# EasyEDA Pro project CD Air Detector_V2.0.eprj

# Schematic Schematic1
Create Date: 2024-07-20; Page Name: P1; Project Name: CC Air Detector_V2.0; Schematic Name: Schematic1; Update Date: 2024-07-20
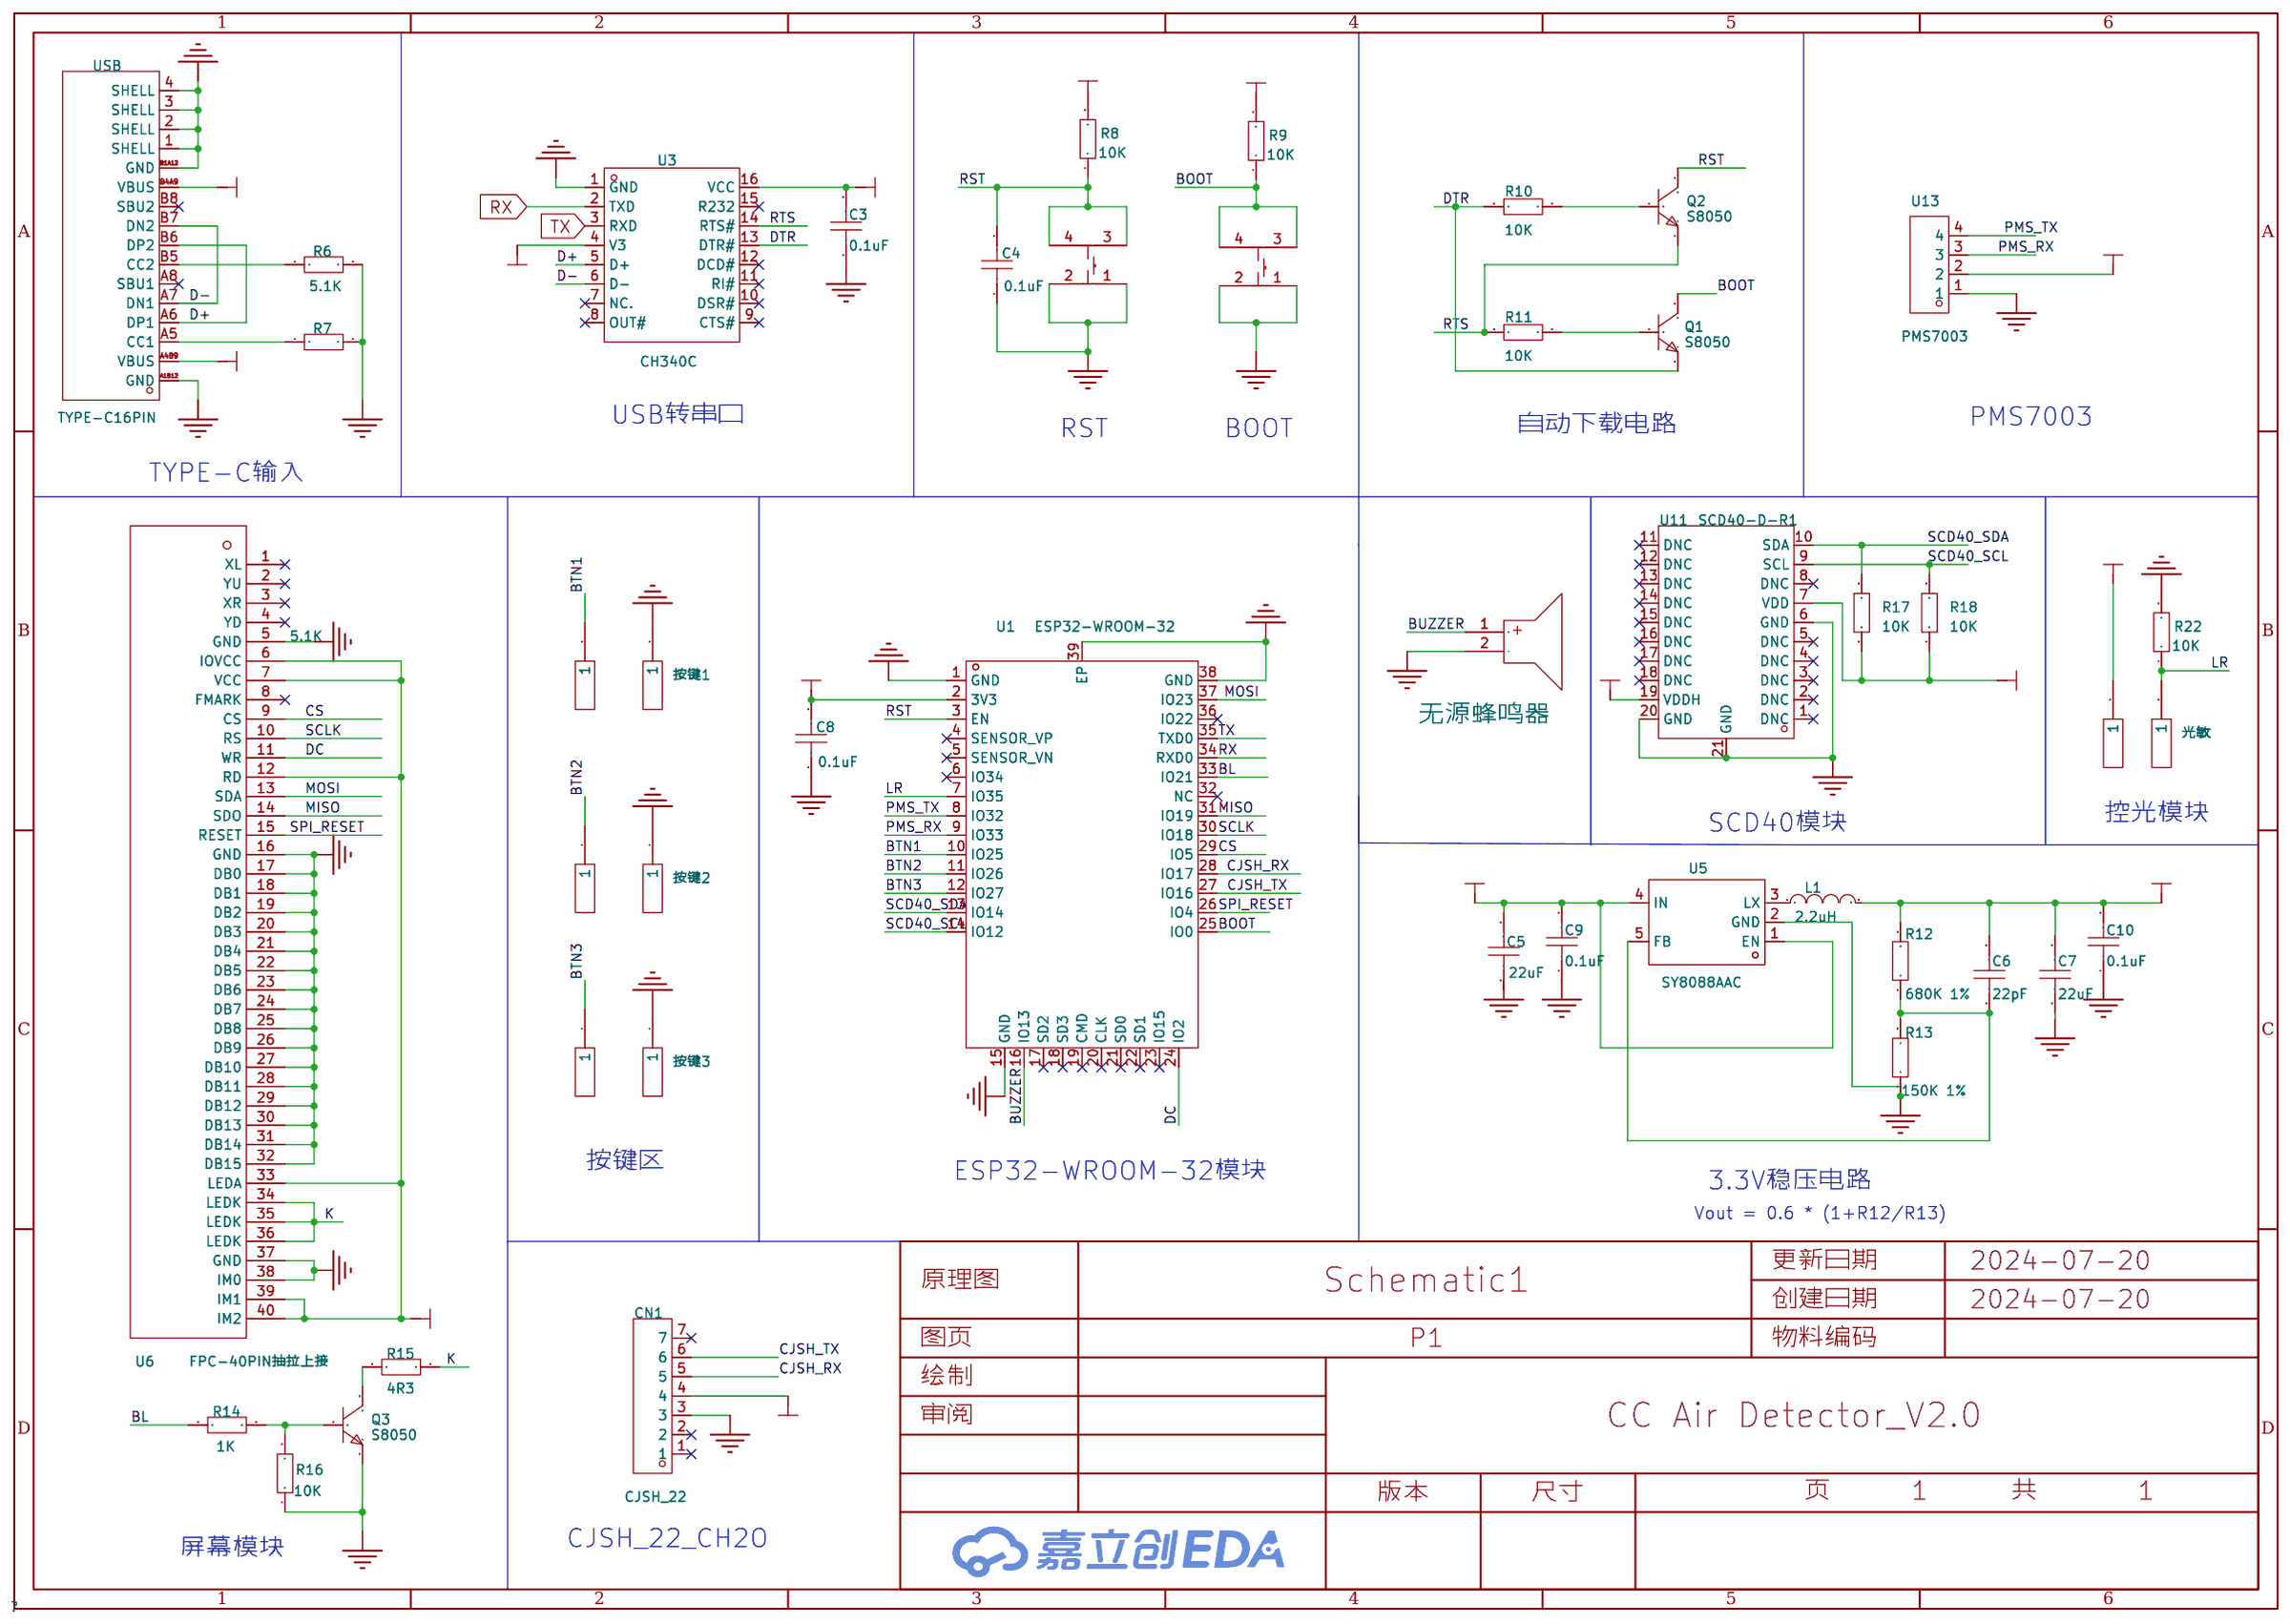
[diagram p0: schematic sheet]

## Parts
C3  0.1uF  [C0805]
C4  0.1uF  [C0805]
C5  22uF  [C0805]
C6  22pF  [C0805]
C7  22uF  [C0805]
C8  0.1uF  [C0805]
C9  0.1uF  [C0805]
C10  0.1uF  [C0805]
CN1  CJSH_22  [CONN-TH_1.25T-7P-DP]
L1  2.2uH  [0630电感]
Q1  S8050  [SOT-23-3_L2.9-W1.3-P1.90-LS2.4-BR]
Q2  S8050  [SOT-23-3_L2.9-W1.3-P1.90-LS2.4-BR]
Q3  S8050  [SOT-23-3_L2.9-W1.3-P1.90-LS2.4-BR]
R6  5.1K  [R0805]
R7  5.1K  [R0805]
R8  10K  [R0805]
R9  10K  [R0805]
R10  10K  [R0805]
R11  10K  [R0805]
R12  680K 1%  [R0805]
R13  150K 1%  [R0805]
R14  1K  [R0805]
R15  4R3  [R0805]
R16  10K  [R0805]
R17  10K  [R0805]
R18  10K  [R0805]
R22  10K  [R0805]
U1  ESP32-WROOM-32  [WIFIM-SMD_ESP-WROOM-32]
U2  贴片按键(轻触开关)  [SW-SMD_4P-L4.2-W3.2-P2.15-LS4.6]
U3  CH340C  [SOP-16_L10.0-W3.9-P1.27-LS6.0-BL]
U4  贴片按键(轻触开关)  [SW-SMD_4P-L4.2-W3.2-P2.15-LS4.6]
U5  SY8088AAC  [SOT-23-5_L3.0-W1.7-P0.95-LS2.8-BR]
U6  FPC-40PIN抽拉上接  [FPC_40PIN]
U8  -  [长圆形单面焊盘]
U9  -  [长圆形单面焊盘]
U10  -  [长圆形单面焊盘]
U11  SCD40-D-R1  [LGA-20_L10.1-W10.1-P1.25-TL]
U12  -  [长圆形单面焊盘]
U13  PMS7003  [CONN-TH_4P-P2.50-XH2.54-4P]
USB  TYPE-C16PIN  [USB-C-SMD_TYPE-C16PIN]
光敏  -  [长圆形单面焊盘]
按键1  -  [长圆形单面焊盘]
按键2  -  [长圆形单面焊盘]
按键3  -  [长圆形单面焊盘]
无源蜂鸣器  无源蜂鸣器  [SMD7525 BEEP]

## Library data of the parts
C3-C5 C8-C10 = CAP_0805: Supplier Footprint: 0805
C6 C7 = CAP_0603: Supplier Footprint: 0603
CN1 = 1.25T-7P-DP: 插针结构:1x7P;间距:1.25mm;安装方式:直插;参考系列:-;总PIN数:7P;排数:1;每排PIN数:7;行距:-;额定电流:1A;工作温度范围:-25℃~+85℃;; LCSC Part Name: 1x7P 间距:1.25mm 直插; Supplier Part: C2689929; Manufacturer: 韩国韩荣; Supplier Footprint: 插件,P=1.25mm; JLCPCB Part Class: 扩展库; Datasheet: https://atta.szlcsc.com/upload/public/pdf/source/20210511/C145936_7E552BBBEA0510A148F12D708BF3BB1D.pdf; Supplier: LCSC; Pins Structure: 1x7P; Pitch: 1.25mm; Mounting Style: 直插; Number of Pins: 7P; Number of Rows: 1; Number of PINs Per Row: 7; Current Rating (Max): 1A; Operating Temperature Range: -25℃~+85℃
L1 = L_0805: Supplier Footprint: L0805
Q1-Q3 = S8050: NPN 25V 500mA 120-400 SOT-23; Supplier Part: C2931719; Manufacturer: Doeshare(德芯); Supplier Footprint: SOT-23; JLCPCB Part Class: 扩展库; Datasheet: https://atta.szlcsc.com/upload/public/pdf/source/20220117/E6D3315E0D6ADDB25840BFFAC039C5C0.pdf; Supplier: LCSC
R6-R11 R15-R18 R22 = Res_0805: Supplier Footprint: 0805
R12-R14 = Res_0603: Supplier Footprint: 0603
U1 = ESP32-WROOM-32: WiFi+双模蓝牙 双核CPU 网口 顶配MCU 低功耗蓝牙 ESP32系列ESP-WROOM-32模组/ESP-32S 4MB; Supplier Part: C95209; Manufacturer: ESPRESSIF(乐鑫); JLCPCB Part Class: 扩展库; Datasheet: https://atta.szlcsc.com/upload/public/pdf/source/20170925/C95209_1506321763821990573.pdf; Supplier: LCSC
U2 U4 = 贴片按键(轻触开关): Supplier Part: C9900009062; Supplier Footprint: PTS810-3mm*4mm*2.5mm(4脚); JLCPCB Part Class: 扩展库; Supplier: LCSC
U3 = CH340C: 应用功能:收发器;接口协议:USB 2.0;数据速率:2Mbps;; LCSC Part Name: CH340C USB转串口芯片 CH340; Supplier Part: C84681; Manufacturer: WCH(南京沁恒); Supplier Footprint: SOP-16; JLCPCB Part Class: 扩展库; Datasheet: https://atta.szlcsc.com/upload/public/pdf/source/20200819/C84681_ADBED554CE321879DBD6B1D06488689C.pdf; Supplier: LCSC; Applications Function: 收发器; Protocol: USB 2.0; Supply Voltage: 3.3V；5V; Data Rate: 2Mbps
U5 = SY8088AAC: 功能类型:降压型;输入电压:-;输出电流(最大值):-;; Supplier Part: C79313; Manufacturer: silergy(矽力杰); Supplier Footprint: SOT-23-5; JLCPCB Part Class: 扩展库; Datasheet: https://atta.szlcsc.com/upload/public/pdf/source/20170329/1490752163260.pdf; Supplier: LCSC; Function: 降压型; Switch tube (built-in/external): 内置
U6 = FPC_连接器_40PIN
U8-U10 U12 光敏 按键1-按键3 = 长圆形单面焊盘
U11 = SCD40-D-R1: 气体类型:空气质量;精度:±5%;; LCSC Part Name: 3.000.496; Supplier Part: C3037696; Manufacturer: Sensirion(瑞士盛思锐); Supplier Footprint: SMD; JLCPCB Part Class: 扩展库; Datasheet: https://atta.szlcsc.com/upload/public/pdf/source/20230320/B8496A095FB9AF4BA49DBD56DDF6C7AD.pdf; Supplier: LCSC; Type: 空气质量; Resolution: ±5%; Operating Temperature: -10℃~+60℃
U13 = xh2.54-4p(直针): Supplier Part: C9900015350; JLCPCB Part Class: 扩展库; Supplier: LCSC
USB = TYPE-C16PIN: 连接器类型:Type-C;标准:-;公母:母;端口数量:1;触点数量:16P;安装方式:卧贴;额定电流 - 电源:3A;工作温度范围:-40℃~+85℃;; LCSC Part Name: Type-C 母 卧贴; Supplier Part: C393939; Manufacturer: SHOU HAN(首韩); Supplier Footprint: SMD; JLCPCB Part Class: 扩展库; Datasheet: https://atta.szlcsc.com/upload/public/pdf/source/20190521/C393939_7B9043D4CF1026AF443AB60D91FBCD5C.pdf; Supplier: LCSC; Connector Type: Type-C; Gender: 母; Number of Ports: 1; Number of Contacts: 16P; Mounting Style: 卧贴; Current Rating - Power (Max): 3A; Operating Temperature Range: -40℃~+85℃
无源蜂鸣器 = YS-MBZ12095C05R42K4000: LCSC Part Name: 蜂鸣器 无源5V42欧4000HZ; Supplier Part: C2891357; Manufacturer: Fengming(锋鸣电子); Supplier Footprint: 插件,P=6.5mm; Datasheet: https://atta.szlcsc.com/upload/public/pdf/source/20210903/1BFBC8824417868F880E44F43CB98B3A.pdf; Supplier: LCSC

## Nets
3V3: C3.2 C6.2 C7.2 C8.2 C10.2 L1.2 R8.2 R9.2 R12.2 R17.1 R18.1 U1.2(3V3) U3.4(V3) U3.16(VCC) U6.6(IOVCC) U6.7(VCC) U6.12(RD) U6.33(LEDA) U6.39(IM1) U6.40(IM2) U11.7(VDD) U11.19(VDDH) U12.1
GND: C3.1 C4.1 C5.1 C7.1 C8.1 C9.1 C10.1 CN1.3 Q3.2(E) R6.2 R7.2 R13.1 R16.1 R22.2 U1.1(GND) U1.15(GND) U1.38(GND) U1.39(EP) U2.1 U2.2 U3.1(GND) U4.1 U4.2 U5.2(GND) U6.5(GND) U6.16(GND) U6.17(DB0) U6.18(DB1) U6.19(DB2) U6.20(DB3) U6.21(DB4) U6.22(DB5) U6.23(DB6) U6.24(DB7) U6.25(DB8) U6.26(DB9) U6.27(DB10) U6.28(DB11) U6.29(DB12) U6.30(DB13) U6.31(DB14) U6.32(DB15) U6.37(GND) U6.38(IM0) U11.6(GND) U11.20(GND) U11.21(GND) U13.1 USB.1(SHELL) USB.2(SHELL) USB.3(SHELL) USB.4(SHELL) USB.A1B12(GND) USB.B1A12(GND) 按键1.1 按键2.1 按键3.1 无源蜂鸣器.2(-)
VBUS: C5.2 C9.2 CN1.4 U5.1(EN) U5.4(IN) U13.2 USB.A4B9(VBUS) USB.B4A9(VBUS)
BL: R14.1 U1.33(IO21)
BOOT: Q1.3(C) R9.1 U1.25(IO0) U4.3 U4.4
BTN1: U1.10(IO25) U8.1
BTN2: U1.11(IO26) U9.1
BTN3: U1.12(IO27) U10.1
BUZZER: U1.16(IO13) 无源蜂鸣器.1(+)
CJSH_RX: CN1.5 U1.28(IO17)
CJSH_TX: CN1.6 U1.27(IO16)
CS: U1.29(IO5) U6.9(CS)
D+: U3.5(D+) USB.A6(DP1) USB.B6(DP2)
D-: U3.6(D-) USB.A7(DN1) USB.B7(DN2)
DC: U1.24(IO2) U6.11(WR)
DTR: Q1.2(E) R10.1 U3.13(DTR#)
K: R15.2 U6.34(LEDK) U6.35(LEDK) U6.36(LEDK)
LR: R22.1 U1.7(IO35) 光敏.1
MISO: U1.31(IO19) U6.14(SDO)
MOSI: U1.37(IO23) U6.13(SDA)
PMS_RX: U1.9(IO33) U13.3
PMS_TX: U1.8(IO32) U13.4
RST: C4.2 Q2.3(C) R8.1 U1.3(EN) U2.3 U2.4
RTS: Q2.2(E) R11.1 U3.14(RTS#)
RX: U1.34(RXD0) U3.2(TXD)
SCD40_SCL: R18.2 U1.14(IO12) U11.9(SCL)
SCD40_SDA: R17.2 U1.13(IO14) U11.10(SDA)
SCLK: U1.30(IO18) U6.10(RS)
SPI_RESET: U1.26(IO4) U6.15(RESET)
TX: U1.35(TXD0) U3.3(RXD)
$1N3236: R6.1 USB.B5(CC2)
$1N3239: R7.1 USB.A5(CC1)
$1N4518: Q2.1(B) R10.2
$1N4546: Q1.1(B) R11.2
$1N5000: L1.1 U5.3(LX)
$1N5124: C6.1 R12.1 R13.2 U5.5(FB)
$1N7211: Q3.1(B) R14.2 R16.2
$1N8578: Q3.3(C) R15.1

Not connected (* = marked no-connect by the designer): CN1 1* 2* 7*; U1 4(SENSOR_VP)* 5(SENSOR_VN)* 6(IO34)* 17(SD2)* 18(SD3)* 19(CMD)* 20(CLK)* 21(SD0)* 22(SD1)* 23(IO15)* 32(NC)* 36(IO22)*; U3 7(NC.)* 8(OUT#)* 9(CTS#)* 10(DSR#)* 11(RI#)* 12(DCD#)* 15(R232)*; U6 1(XL)* 2(YU)* 3(XR)* 4(YD)* 8(FMARK)*; U11 1(DNC)* 2(DNC)* 3(DNC)* 4(DNC)* 5(DNC)* 8(DNC)* 11(DNC)* 12(DNC)* 13(DNC)* 14(DNC)* 15(DNC)* 16(DNC)* 17(DNC)* 18(DNC)*; USB A8(SBU1)* B8(SBU2)*

## Notes on the sheet
- USB转串口
- PMS7003
- RST
- BOOT
- 自动下载电路
- TYPE-C输入
- SCD40模块
- 控光模块
- 按键区
- ESP32-WROOM-32模块
- 3.3V稳压电路
- Vout = 0.6 * (1+R12/R13)
- CJSH_22_CH2O
- 屏幕模块

# Board PCB2
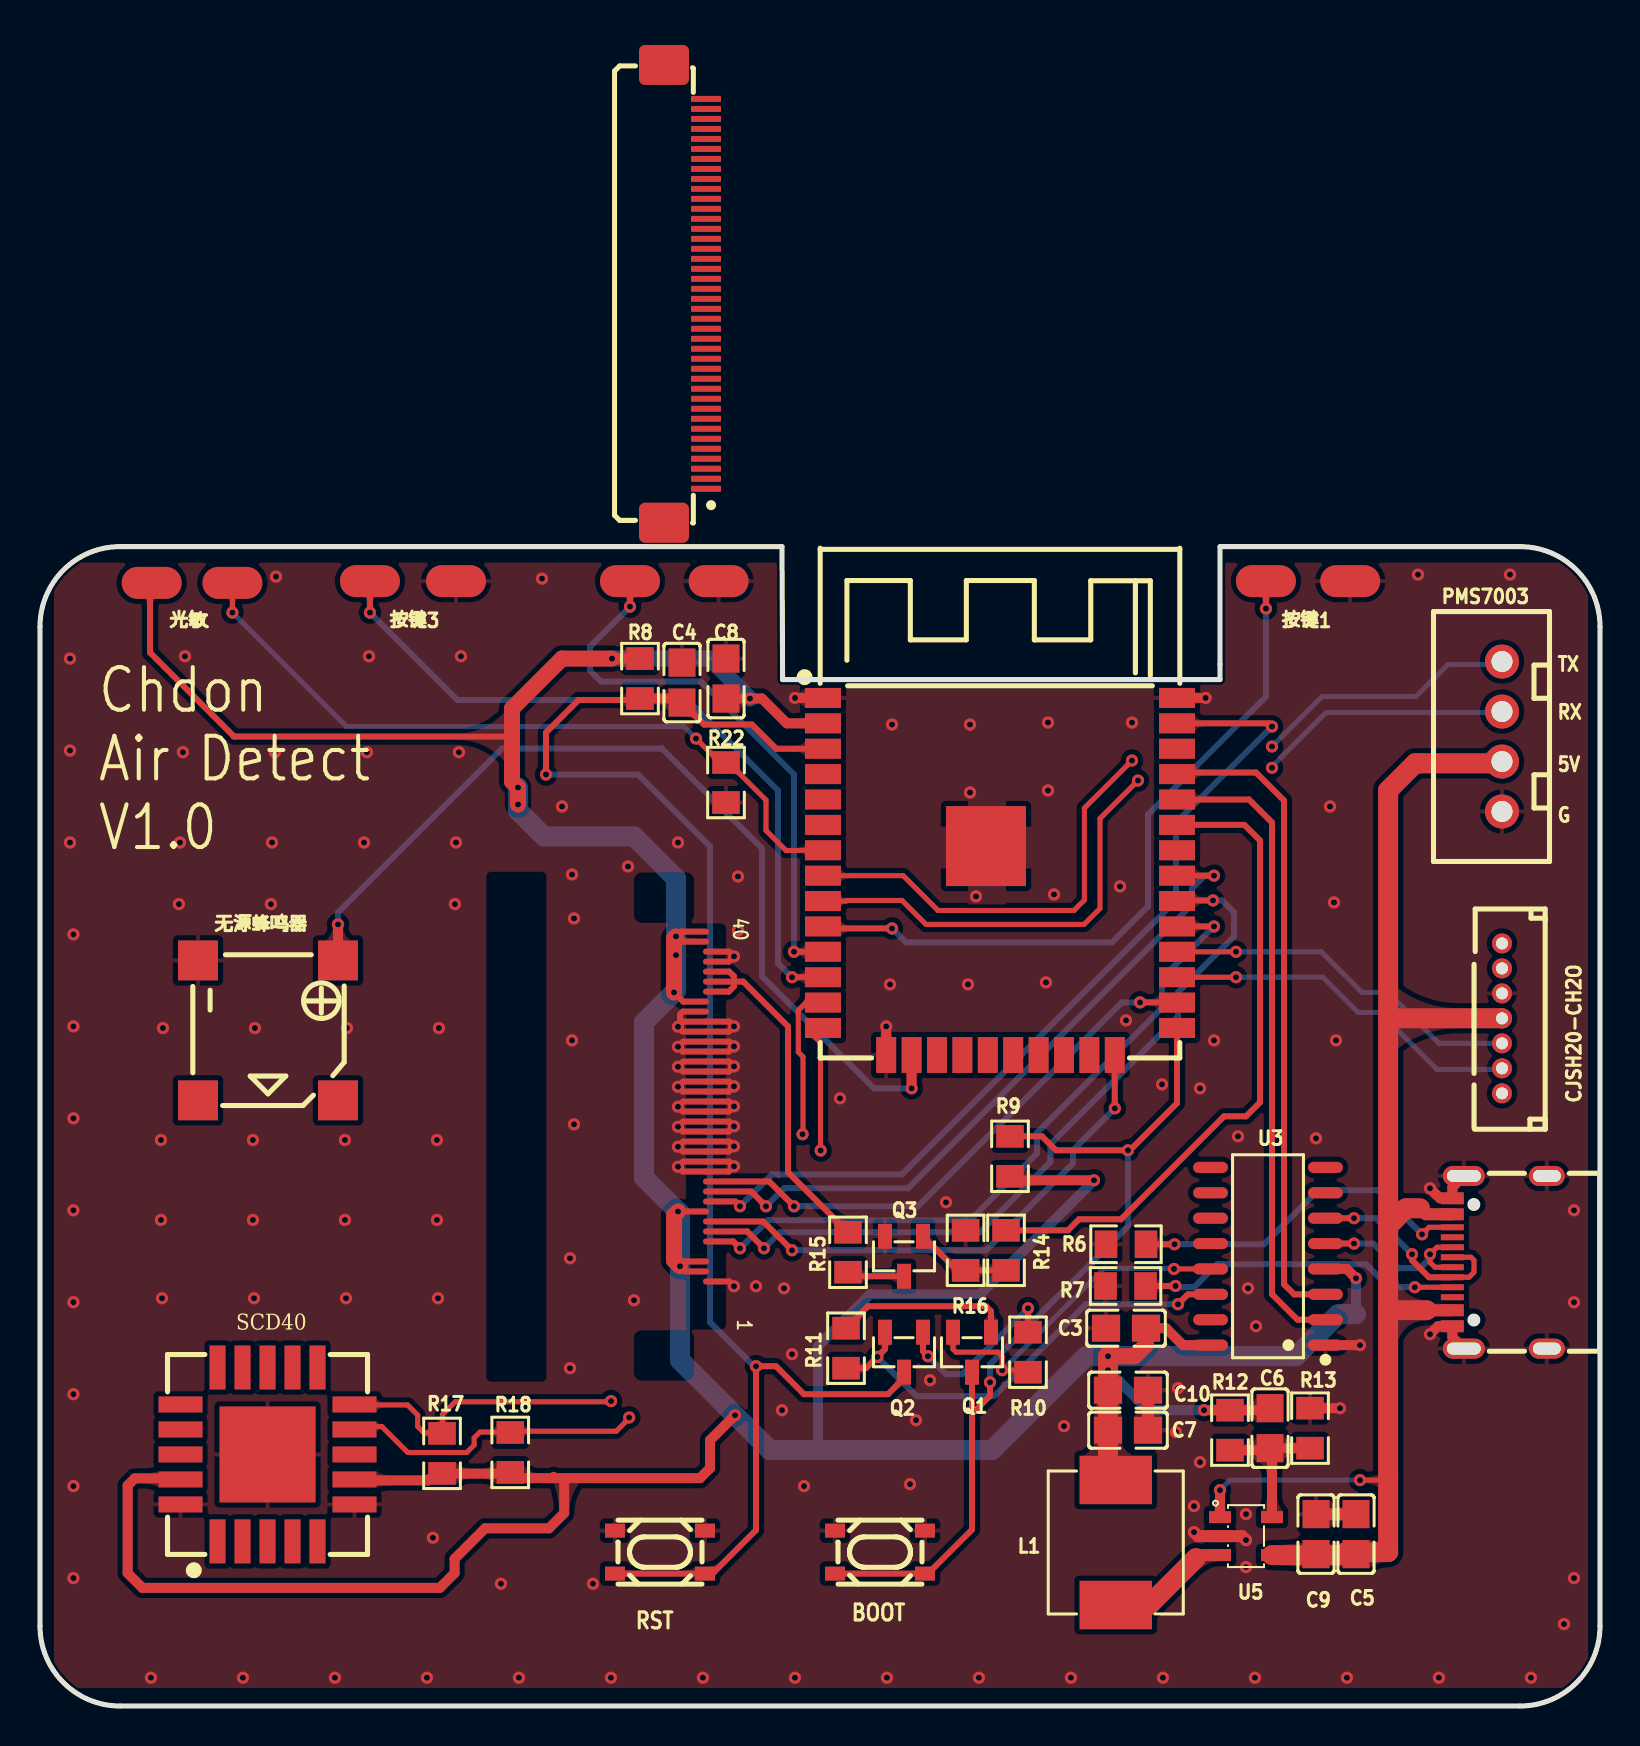
[diagram p1: board, top side]
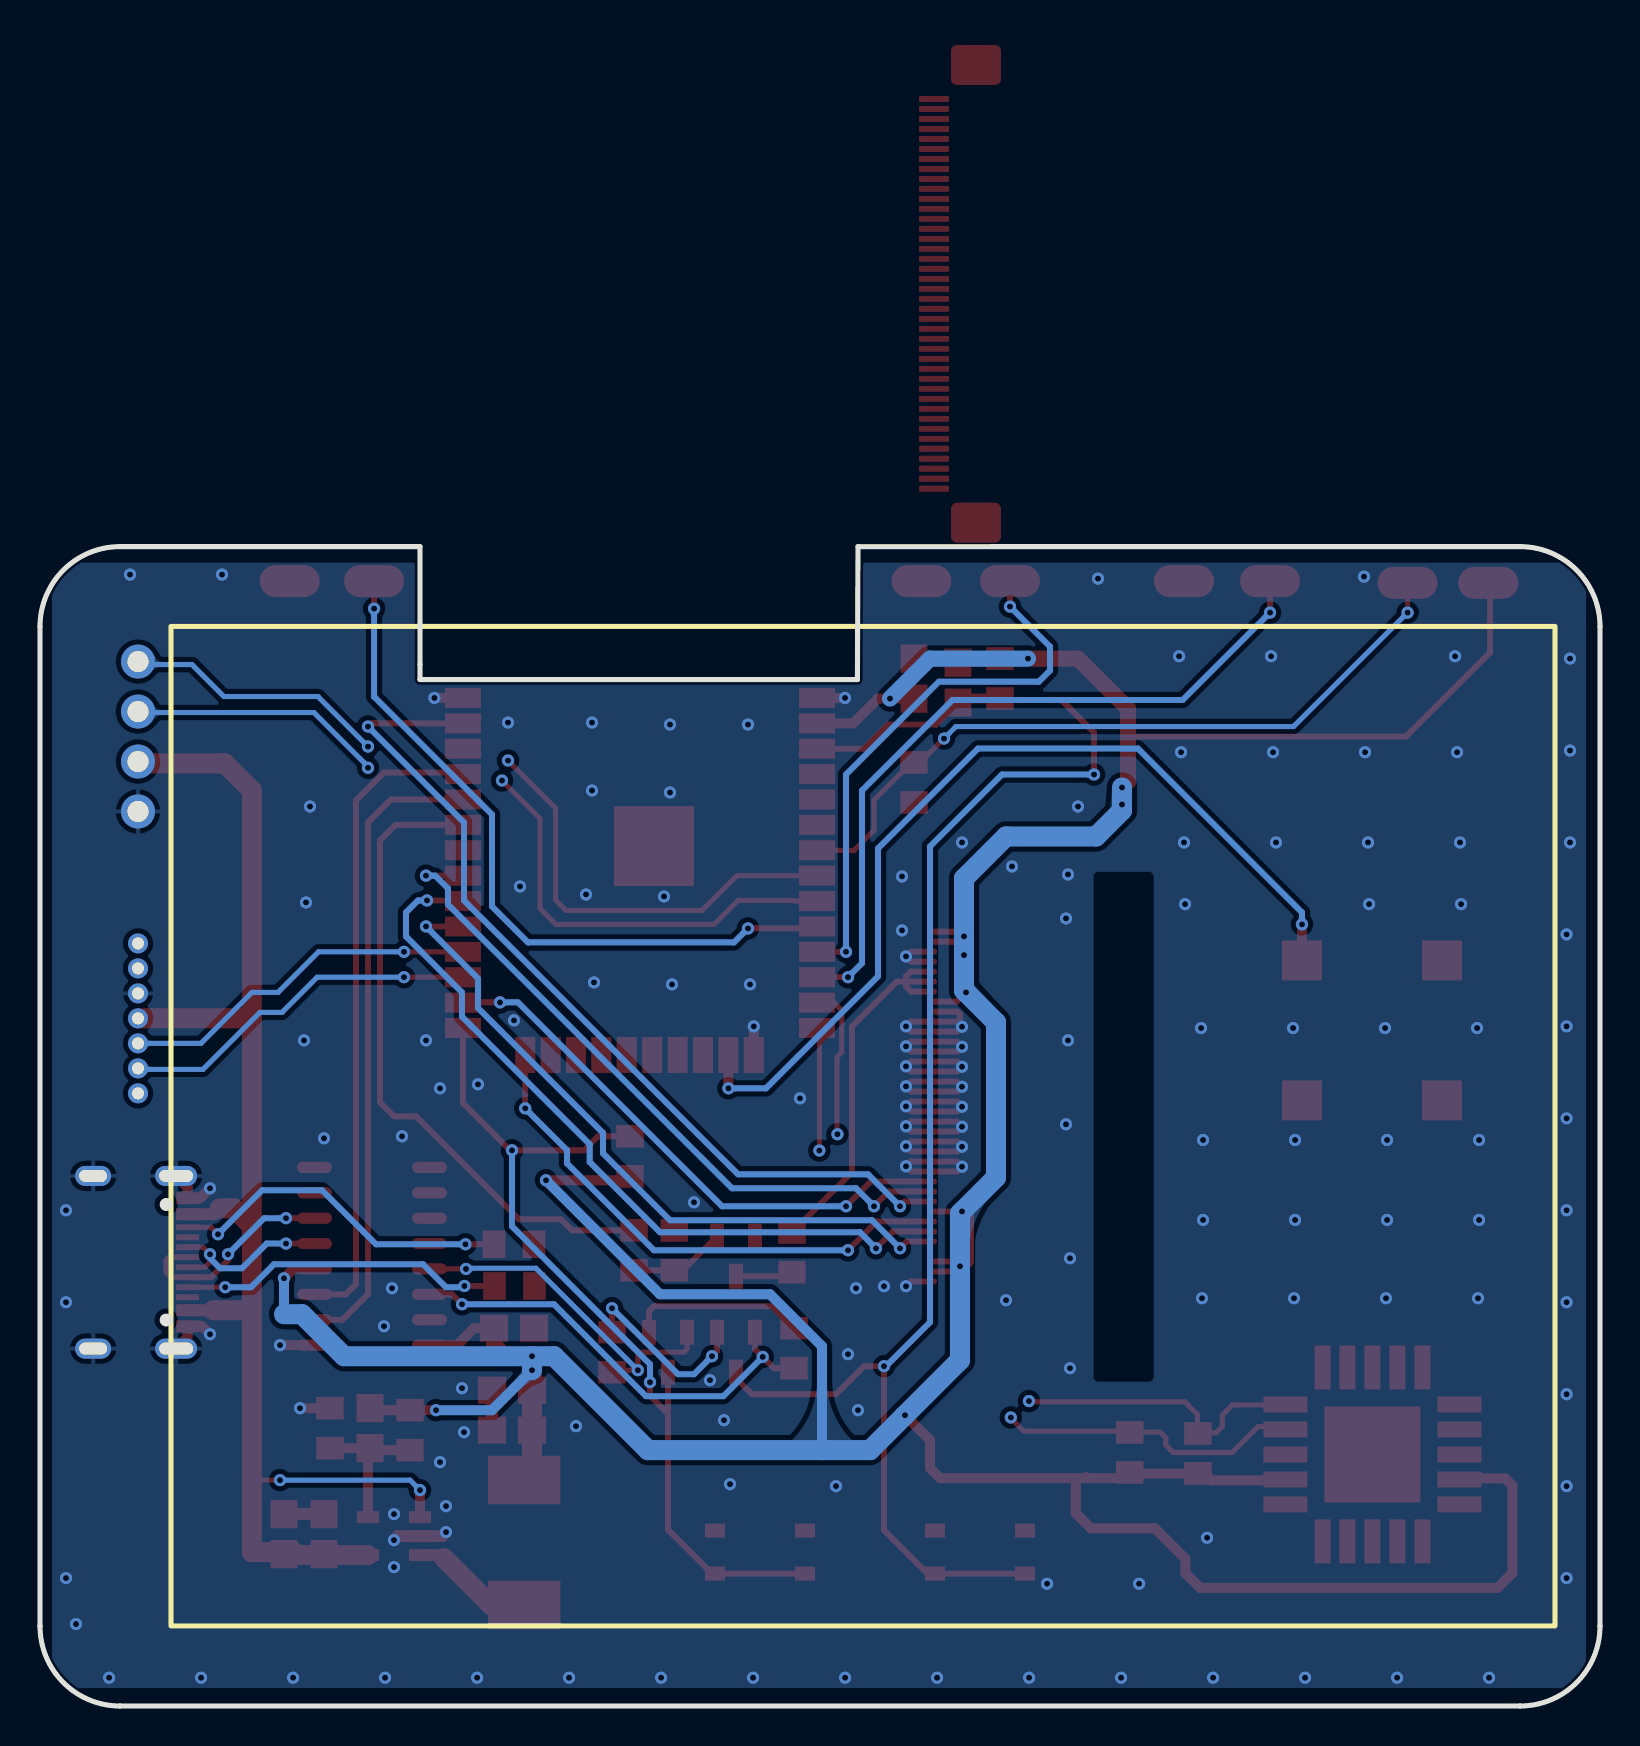
[diagram p2: board, bottom side, seen from below]

Outline 78 x 58 mm; copper layers: Top Layer, 信号层, GND, Bottom Layer. Coordinates in mm from the lower left corner of the outline.
Outline path: 0,54 0,4 arc(1.17,1.17) 4,0 74,0 arc(76.83,1.17) 78,4 78,54 arc(76.83,56.83) 74,58 59,58 59,51.35 38.7,51.35 37.13,51.35 37.1,58 4,58 arc(1.17,56.83) 0,54
Stack: Top Layer 0.035mm 外层铜厚1oz / Dielectric1 0.2104mm 7628 RC49% 8.6mil / 信号层 0.0152mm 内层铜厚 / Dielectric2 1.065mm 1.1mm H/HOZ Copper / GND 0.0152mm 内层铜厚 / Dielectric3 0.2104mm 7628 RC49% 8.6mil / Bottom Layer 0.035mm 外层铜厚1oz

## Design rules (mm)
template: 自定义配置
spacing copperThickness1oz (default): track to track 0.152, other pairs 0.152 to 0.381
spacing copperThickness2oz: track to track 0.203, other pairs 0.152 to 0.3
track width copperThickness1oz (default): min 0.127, default 0.254, max 2.54
track width copperThickness2oz: min 0.203, default 0.254, max 2.54
differential pair differentialPair (default): width min 0.127, default 0.254, max 2.54; gap min 0.152, default 0.152
via viaSize (default): diameter min 0.5, default 0.61, max 10; hole min 0.3, default 0.305, max 6.299

## Placement (name value [footprint] x y rotation side)
C3  0.1uF  [C0805]  54.3 18.9 0 top
C4  0.1uF  [C0805]  32.1 51.2 270 top
C5  22uF  [C0805]  65.8 8.6 270 top
C6  22pF  [C0805]  61.5 13.9 90 top
C7  22uF  [C0805]  54.4 13.8 180 top
C8  0.1uF  [C0805]  34.3 51.4 270 top
C9  0.1uF  [C0805]  63.8 8.6 270 top
C10  0.1uF  [C0805]  54.4 15.8 180 top
CJSH20-CH2O  CJSH_22  [CONN-TH_1.25T-7P-DP]  73.1 34.4 90 top
L1  2.2uH  [0630电感]  52.9 7.8 270 top
PMS7003  PMS7003  [CONN-TH_4P-P2.50-XH2.54-4P]  73.1 48.5 270 top
Q1  S8050  [SOT-23-3_L2.9-W1.3-P1.90-LS2.4-BR]  46.6 17.7 90 top
Q2  S8050  [SOT-23-3_L2.9-W1.3-P1.90-LS2.4-BR]  43.2 17.7 90 top
Q3  S8050  [SOT-23-3_L2.9-W1.3-P1.90-LS2.4-BR]  43.2 22.5 90 top
R6  5.1K  [R0805]  54.3 23.1 180 top
R7  5.1K  [R0805]  54.28 21.01 180 top
R8  10K  [R0805]  30 51.4 90 top
R9  10K  [R0805]  48.5 27.5 270 top
R10  10K  [R0805]  49.4 17.7 90 top
R11  10K  [R0805]  40.3 17.9 90 top
R12  680K 1%  [R0805]  59.5 13.8 90 top
R13  150K 1%  [R0805]  63.5 13.9 270 top
R14  1K  [R0805]  48.3 22.8 270 top
R15  4R3  [R0805]  40.4 22.7 90 top
R16  10K  [R0805]  46.28 22.8 270 top
R17  10K  [R0805]  20.1 12.64 90 top
R18  10K  [R0805]  23.51 12.69 90 top
R22  10K  [R0805]  34.3 46.2 270 top
SCD40  SCD40-D-R1  [LGA-20_L10.1-W10.1-P1.25-TL]  11.38 12.58 90 top
U1  ESP32-WROOM-32  [WIFIM-SMD_ESP-WROOM-32]  48 41.5 0 top
U2  贴片按键(轻触开关)  [SW-SMD_4P-L4.2-W3.2-P2.15-LS4.6]  31 7.7 0 top
U3  CH340C  [SOP-16_L10.0-W3.9-P1.27-LS6.0-BL]  61.4 22.5 90 top
U4  贴片按键(轻触开关)  [SW-SMD_4P-L4.2-W3.2-P2.15-LS4.6]  42 7.7 0 top
U5  SY8088AAC  [SOT-23-5_L3.0-W1.7-P0.95-LS2.8-BR]  60.3 8.5 180 top
U6  FPC-40PIN抽拉上接  [FPC_40PIN]  33.3 38.74 0 top
U8  -  [长圆形单面焊盘]  61.3 56.4 0 top
U9  -  [长圆形单面焊盘]  29.5 56.4 0 top
U10  -  [长圆形单面焊盘]  16.5 56.4 0 top
U12  -  [长圆形单面焊盘]  5.58 56.31 0 top
USB  TYPE-C16PIN  [USB-C-SMD_TYPE-C16PIN]  72.98 22.2 90 top
光敏  -  [长圆形单面焊盘]  9.62 56.31 0 top
按键1  -  [长圆形单面焊盘]  65.51 56.4 0 top
按键2  -  [长圆形单面焊盘]  33.93 56.4 0 top
按键3  -  [长圆形单面焊盘]  20.8 56.4 0 top
无源蜂鸣器  无源蜂鸣器  [SMD7525 BEEP]  11.4 33.8 270 top

## Footprints (pads in the part's own frame, mm; a bottom-side part is the same pattern mirrored in y, then rotated)
0630电感
  rect 2.424x3.62 smd: 1(2.747,0.889) 2(-3.509,0.889)
C0805
  rect 1.41x1.35 smd: 1(-1,0) 2(1,0)
CONN-TH_1.25T-7P-DP
  round 1 hole 0.6: 1(3.75,0) 2(2.5,0) 3(1.25,0) 4(0,0) 5(-1.25,0) 6(-2.5,0) 7(-3.75,0)
CONN-TH_4P-P2.50-XH2.54-4P
  round 1.7 hole 1.05: 1(3.75,0) 2(1.25,0) 3(-1.25,0) 4(-3.75,0)
FPC_40PIN
  rrect 1.5x0.3 smd: 1(0,22.156) 2(0,22.656) 3(0,23.156) 4(0,23.656) 5(0,24.156) 6(0,24.656) 7(0,25.156) 8(0,25.656) 9(0,26.156) 10(0,26.656) 11(0,27.156) 12(0,27.656) 13(0,28.156) 14(0,28.656) 15(0,29.156) 16(0,29.656) 17(0,30.156) 18(0,30.656) 19(0,31.156) 20(0,31.656) 21(0,32.156) 22(0,32.656) 23(0,33.156) 24(0,33.656) 25(0,34.156) 26(0,34.656) 27(0,35.156) 28(0,35.656) 29(0,36.156) 30(0,36.656) 31(0,37.156) 32(0,37.656) 33(0,38.156) 34(0,38.656) 35(0,39.156) 36(0,39.656) 37(0,40.156) 38(0,40.656) 39(0,41.156) 40(0,41.656)
  rrect 2.5x2 smd: 41(-2.1,43.356) 42(-2.1,20.456)
LGA-20_L10.1-W10.1-P1.25-TL
  rect 2.2x0.8 smd: 1(-4.35,2.5) 2(-4.35,1.25) 3(-4.35,0) 4(-4.35,-1.25) 5(-4.35,-2.5) 11(4.35,-2.5) 12(4.35,-1.25) 13(4.35,0) 14(4.35,1.25) 15(4.35,2.5)
  rect 0.8x2.2 smd: 6(-2.5,-4.35) 7(-1.25,-4.35) 8(0,-4.35) 9(1.25,-4.35) 10(2.5,-4.35) 16(2.5,4.35) 17(1.25,4.35) 18(0,4.35) 19(-1.25,4.35) 20(-2.5,4.35)
  rect 4.8x4.8 smd: 21(0,0)
R0805
  rect 1.133x1.377 smd: 1(-1,0) 2(1,0)
SMD7525 BEEP
  rect 1.999x1.999 smd: 1(-3.5,3.5) 2(-3.5,-3.5) 3(3.5,-3.5) 4(3.5,3.5)
SOP-16_L10.0-W3.9-P1.27-LS6.0-BL
  oval 0.56x1.745 smd: 1(-4.445,-2.873) 2(-3.175,-2.873) 3(-1.905,-2.873) 4(-0.635,-2.873) 5(0.635,-2.873) 6(1.905,-2.873) 7(3.175,-2.873) 8(4.445,-2.873) 9(4.445,2.873) 10(3.175,2.873) 11(1.905,2.873) 12(0.635,2.873) 13(-0.635,2.873) 14(-1.905,2.873) 15(-3.175,2.873) 16(-4.445,2.873)
SOT-23-3_L2.9-W1.3-P1.90-LS2.4-BR
  rect 1.25x0.7 smd: 1(1,-0.95) 2(1,0.95) 3(-1,0)
SOT-23-5_L3.0-W1.7-P0.95-LS2.8-BR
  rect 1.1x0.6 smd: 1(1.3,-0.95) 2(1.3,0) 3(1.3,0.95) 4(-1.3,0.95) 5(-1.3,-0.95)
SW-SMD_4P-L4.2-W3.2-P2.15-LS4.6
  rect 1x0.7 smd: 1(-2.25,1.075) 2(2.25,1.075) 3(-2.25,-1.075) 4(2.25,-1.075)
USB-C-SMD_TYPE-C16PIN
  oval 1x2.1 hole 0.6x1.7: 1(-4.32,1.788) 2(4.32,1.788)
  oval 1x1.8 hole 0.6x1.4: 3(-4.32,-2.362) 4(4.32,-2.362)
  rect 0.6x1.15 smd: A1B12(-3.2,2.362) A4B9(-2.4,2.362) B1A12(3.2,2.362) B4A9(2.4,2.362)
  rect 0.3x1.15 smd: A5(-1.25,2.362) A6(-0.25,2.362) A7(0.25,2.362) A8(-1.75,2.362) B5(1.75,2.362) B6(0.75,2.362) B7(-0.75,2.362) B8(1.25,2.362)
WIFIM-SMD_ESP-WROOM-32
  rect 1.8x1.001 smd: 1(-8.851,8.931) 2(-8.851,7.66) 3(-8.851,6.391) 4(-8.851,5.12) 5(-8.851,3.85) 6(-8.851,2.58) 7(-8.851,1.31) 8(-8.851,0.041) 9(-8.851,-1.23) 10(-8.851,-2.499) 11(-8.851,-3.769) 12(-8.851,-5.04) 13(-8.851,-6.309) 14(-8.851,-7.58) 25(8.851,-7.58) 26(8.851,-6.309) 27(8.851,-5.04) 28(8.851,-3.769) 29(8.851,-2.499) 30(8.851,-1.23) 31(8.851,0.041) 32(8.851,1.31) 33(8.851,2.58) 34(8.851,3.85) 35(8.851,5.12) 36(8.851,6.391) 37(8.851,7.66) 38(8.851,8.931)
  rect 1.001x1.8 smd: 15(-5.689,-8.931) 16(-4.42,-8.931) 17(-3.15,-8.931) 18(-1.879,-8.931) 19(-0.61,-8.931) 20(0.66,-8.931) 21(1.931,-8.931) 22(3.2,-8.931) 23(4.471,-8.931) 24(5.74,-8.931)
  rect 4x4 smd: 39(-0.7,1.52)
长圆形单面焊盘
  oval 3x1.6 smd: 1(0,-0.127)

## Nets
3V3: C3.2 C6.2 C7.2 C8.2 C10.2 L1.2 R8.2 R9.2 R12.2 R17.1 R18.1 SCD40.7 SCD40.19 U1.2 U3.4 U3.16 U6.6 U6.7 U6.12 U6.33 U6.39 U6.40 U12.1
GND: C3.1 C4.1 C5.1 C7.1 C8.1 C9.1 C10.1 CJSH20-CH2O.3 PMS7003.1 Q3.2 R6.2 R7.2 R13.1 R16.1 R22.2 SCD40.6 SCD40.20 SCD40.21 U1.1 U1.15 U1.38 U1.39 U2.1 U2.2 U3.1 U4.1 U4.2 U5.2 U6.5 U6.16 U6.17 U6.18 U6.19 U6.20 U6.21 U6.22 U6.23 U6.24 U6.25 U6.26 U6.27 U6.28 U6.29 U6.30 U6.31 U6.32 U6.37 U6.38 USB.1 USB.2 USB.3 USB.4 USB.A1B12 USB.B1A12 按键1.1 按键2.1 按键3.1 无源蜂鸣器.2
VBUS: C5.2 C9.2 CJSH20-CH2O.4 PMS7003.2 U5.1 U5.4 USB.A4B9 USB.B4A9
BL: R14.1 U1.33
BOOT: Q1.3 R9.1 U1.25 U4.3 U4.4
BTN1: U1.10 U8.1
BTN2: U1.11 U9.1
BTN3: U1.12 U10.1
BUZZER: U1.16 无源蜂鸣器.1
CJSH_RX: CJSH20-CH2O.5 U1.28
CJSH_TX: CJSH20-CH2O.6 U1.27
CS: U1.29 U6.9
D+: U3.5 USB.A6 USB.B6
D-: U3.6 USB.A7 USB.B7
DC: U1.24 U6.11
DTR: Q1.2 R10.1 U3.13
K: R15.2 U6.34 U6.35 U6.36
LR: R22.1 U1.7 光敏.1
MISO: U1.31 U6.14
MOSI: U1.37 U6.13
PMS_RX: PMS7003.3 U1.9
PMS_TX: PMS7003.4 U1.8
RST: C4.2 Q2.3 R8.1 U1.3 U2.3 U2.4
RTS: Q2.2 R11.1 U3.14
RX: U1.34 U3.2
SCD40_SCL: R18.2 SCD40.9 U1.14
SCD40_SDA: R17.2 SCD40.10 U1.13
SCLK: U1.30 U6.10
SPI_RESET: U1.26 U6.15
TX: U1.35 U3.3
$1N3236: R6.1 USB.B5
$1N3239: R7.1 USB.A5
$1N4518: Q2.1 R10.2
$1N4546: Q1.1 R11.2
$1N5000: L1.1 U5.3
$1N5124: C6.1 R12.1 R13.2 U5.5
$1N7211: Q3.1 R14.2 R16.2
$1N8578: Q3.3 R15.1

Pads without a net: CJSH20-CH2O 1 2 7; SCD40 1 2 3 4 5 8 11 12 13 14 15 16 17 18; U1 4 5 6 17 18 19 20 21 22 23 32 36; U3 7 8 9 10 11 12 15; U6 1 2 3 4 8 41 42; USB A8 B8; 无源蜂鸣器 3 4

## Via types
v1: diameter 0.61, hole 0.305, Top Layer to Bottom Layer, 214 vias

## Routing (per net, layer and track width the routed paths; a pad name or vN(x,y) marks a point on that pad's centre or on a via; arc(x,y) is an arc through that point)
3V3: length 244.5
  Top Layer w0.3: 33.3,35.24 32.16,35.24 v1(31.7,35.7) ; 33.3,38.24 32.06,38.24 v1(31.8,38.5) 32.04,38.74 33.3,38.74 ; 33.3,21.74 32.26,21.74 v1(32,22) 32.24,22.24 33.3,22.24 ; U12.1 5.5,56.1 5.5,52.7 9.7,48.5 23.56,48.5 23.6,48.54 ; 33.3,24.74 v1(31.9,24.74)
  Top Layer w0.5: v1(28.6,52.4) R8.2 ; 25.69,11.46 25.69,11.4 ; 25.69,11.4 23.47,11.4 ; 25.69,11.4 33,11.4 33.5,11.9 33.5,13.3 v1(34.75,14.55) ; C8.2 v1(35.5,50.4) 36.1,50.4 37.34,49.16 U1.2 ; U3.4 65.34,21.86 v1(65.8,21.4) ; v1(58.2,14.8) R12.2 61.4,14.8 C6.2 ; C3.2 56.3,18.9 57.15,18.06 U3.16 ; 19.54,11.41 19.41,11.29 16.23,11.29 ; v1(52.7,26.3) 48.7,26.3 R9.2 ; 23.77,11.72 23.68,11.63 20.44,11.63 ; 26.21,11.32 26.21,9.65 25.45,8.89 22.25,8.89 20.73,7.36 20.73,6.65 19.99,5.91 5.12,5.91 4.38,6.65 4.38,11.03 4.74,11.39 6.26,11.39 6.29,11.41
  Top Layer w0.8: v1(31.7,35.7) 31.7,38.4 v1(31.8,38.5) ; v1(53.4,17.5) 54.74,17.5 55.3,18.06 C3.2 ; v1(23.9,45.1) v1(23.9,45.95) 23.6,46.25 23.6,49.9 26.1,52.4 v1(28.6,52.4) ; v1(32,22) 31.7,22.3 31.7,24.54 v1(31.9,24.74) ; v1(53.4,16.8) C10.2
  Top Layer w1: 53.79,11.31 53.4,11.7 C7.2 C10.2 v1(53.4,16.8) v1(53.4,17.5)
  Bottom Layer w0.5: v1(58.2,14.8) 55.4,14.8 v1(53.4,16.8) ; v1(52.7,26.3) 47,20.6 41.5,20.6 38.9,18 38.9,12.8 ; v1(65.8,21.4) 65.8,19.6 65.8,19.6
  Bottom Layer w0.8: v1(28.6,52.4) 33.5,52.4 v1(35.5,50.4)
  Bottom Layer w1: v1(53.4,17.5) 62.8,17.5 64.9,19.6 65.8,19.6 ; v1(53.4,17.5) 52.3,17.5 47.6,12.8 36.5,12.8 v1(34.75,14.55) 32,17.3 v1(32,22) 32,24.64 v1(31.9,24.74) 30.2,26.44 30.2,34.2 v1(31.7,35.7) 31.8,35.8 v1(31.8,37.56) v1(31.8,38.5) 31.8,41.4 29.7,43.5 25.2,43.5 23.9,44.8 v1(23.9,45.95) ; v1(53.4,17.5) v1(53.4,16.8)
GND: length 74.1
  Top Layer w0.3: 33.3,34.74 32.14,34.74 32,34.6 32,34.08 ; 33.3,37.74 34.46,37.74 v1(34.7,37.5) 34.44,37.24 33.3,37.24 ; 32,34.08 32.16,34.24 34.46,34.24 v1(34.7,34) 34.44,33.74 32.14,33.74 v1(31.9,33.98) 32,34.08 ; 33.3,21.24 34.46,21.24 v1(34.7,21) ; 33.3,27.24 34.46,27.24 v1(34.7,27) 34.44,26.74 32.14,26.74 v1(31.9,26.98) 32.16,27.24 33.3,27.24 ; 34.44,31.74 v1(34.7,32) 34.46,32.24 32.16,32.24 v1(31.9,31.98) 32.14,31.74 34.44,31.74 ; 33.3,28.24 32.16,28.24 v1(31.9,27.98) 32.14,27.74 34.44,27.74 v1(34.7,28) 34.46,28.24 33.3,28.24 ; 33.3,33.24 34.46,33.24 v1(34.7,33) 34.44,32.74 32.14,32.74 v1(31.9,32.98) 32.16,33.24 33.3,33.24 ; 33.3,31.24 34.46,31.24 v1(34.7,31) 34.44,30.74 32.14,30.74 v1(31.9,30.98) 32.16,31.24 33.3,31.24 ; 34.44,28.74 v1(34.7,29) 34.46,29.24 32.16,29.24 v1(31.9,28.98) 32.14,28.74 34.44,28.74 ; 32.14,29.74 v1(31.9,29.98) 32.16,30.24 34.46,30.24 v1(34.7,30) 34.44,29.74 32.14,29.74
  Top Layer w0.5: R13.1 v1(65,14.9) ; 42.31,32.57 v1(42.31,34) ; U1.38 v1(58.28,50.43) ; v1(69.5,18.6) 69.9,19 USB.A1B12 70.62,18.45 USB.1 ; U3.1 v1(66,18.06) ; USB.2 70.62,25.94 USB.B1A12 70,25.4 v1(69.5,25.9) ; v1(37.75,50.43) U1.1
  Top Layer w0.6: C10.1 C7.1 ; v1(60.3,8.3) 60.1,8.5 U5.2 57.9,8.5 v1(57.7,8.7) ; C5.1 C9.1
  vias: v1(1.5,52.4) v1(1.5,47.8) v1(1.5,43.2) v1(1.67,38.6) v1(1.67,34) v1(1.67,29.4) v1(1.67,24.8) v1(1.67,20.2) v1(1.67,15.6) v1(1.67,11) v1(1.67,6.4) v1(5.55,1.42) v1(6.05,28.32) v1(6.05,24.32) v1(6.15,33.92) v1(6.1,20.4) v1(6.95,40.12) v1(7,43.2) v1(7.15,47.72) v1(7.25,52.52) v1(10.15,1.42) v1(10.65,28.32) v1(10.65,24.32) v1(10.75,33.92) v1(10.7,20.4) v1(11.55,40.12) v1(11.6,43.2) v1(11.75,47.72) v1(11.8,56.5) v1(14.75,1.42) v1(15.25,28.32) v1(15.25,24.32) v1(15.35,33.92) v1(15.3,20.4) v1(16.2,43.2) v1(16.35,47.72) v1(16.45,52.52) v1(19.35,1.42) v1(19.65,8.42) v1(19.85,28.32) v1(19.85,24.32) v1(19.95,33.92) v1(19.9,20.4) v1(20.75,40.12) v1(20.8,43.2) v1(20.95,47.72) v1(21.05,52.52) v1(23.05,6.12) v1(23.95,1.42) v1(25.1,56.4) v1(26.1,45) v1(26.5,22.4) v1(26.5,16.9) v1(26.6,41.6) v1(26.6,33.3) v1(26.7,39.4) v1(26.7,29.1) v1(27.65,6.12) v1(28.55,1.42) v1(29.4,42) v1(29.7,20.3) v1(31.9,43.2) v1(33.15,1.42) v1(34.9,41.5) v1(34.9,38.8) v1(35.8,21) v1(37.1,14.8) v1(37.2,20.9) v1(37.6,17.6) v1(37.75,1.42) v1(38.2,11) v1(40,30.4) v1(42.35,1.42) v1(42.5,36.1) v1(42.6,49.1) v1(43.5,11.1) v1(43.8,14.3) v1(44.5,16.3) v1(45.3,25.2) v1(46.4,36.1) v1(46.5,49.1) v1(46.5,45.7) v1(46.8,40.5) v1(46.95,1.42) v1(50.3,36.2) v1(50.4,49.2) v1(50.4,45.8) v1(50.7,40.6) v1(51.2,14) v1(51.55,1.42) v1(54,41) v1(54.3,34.3) v1(54.6,49.2) v1(56.1,31.1) v1(56.15,1.42) v1(56.8,13.7) v1(56.9,15.9) v1(57.7,10) v1(58,30.9) v1(58,12.2) v1(58.7,33.3) v1(59.9,28.5) v1(60.3,9.6) v1(60.3,6.95) v1(60.4,20.9) v1(60.75,1.42) v1(60.8,19) v1(63.8,28.4) v1(64.5,45) v1(64.7,40.2) v1(64.8,33.3) v1(65.35,1.42) v1(68.9,56.6) v1(69.95,1.42) v1(73.5,56.6) v1(74.55,1.42) v1(76.2,4.1) v1(76.7,24.8) v1(76.7,20.2) v1(76.7,6.4)
VBUS: length 73.1
  Top Layer w0.254: 67.41,11.41 67.3,11.3 v1(66,11.3)
  Top Layer w0.5: 69.04,47.16 69,47.2 ; U5.1 v1(59,10.8)
  Top Layer w0.6: 69.33,19.8 USB.A4B9 ; 69,24.9 69.3,24.6 USB.B4A9
  Top Layer w1: 67.41,24.01 68.3,24.9 69,24.9 ; 67.41,24.01 67.41,19.84 ; 67.41,24.01 67.41,34.41 ; 67.41,34.41 67.41,45.81 68.76,47.16 73.01,47.16 73.2,47.35 ; 67.41,34.41 73.09,34.41 CJSH20-CH2O.4 ; U5.4 65.15,7.55 65.3,7.7 67.41,7.7 67.41,19.84 ; 69.33,19.8 67.45,19.8 67.41,19.84
  Bottom Layer w0.254: v1(59,10.8) 59.5,11.3 v1(66,11.3)
BL: length 32.9
  Top Layer w0.3: R14.1 51.4,23.8 51.95,24.35 54.05,24.35 59.2,29.5 60.3,29.5 61,30.2 61,43.3 60.22,44.08 U1.33
BOOT: length 45.4
  Top Layer w0.3: U1.25 56.85,30.16 54.49,27.8 50.8,27.8 50.1,28.5 R9.1 ; Q1.3 46.6,14.62 ; 46.6,14.62 47.5,15.52 v1(47.5,16.2) ; 46.6,14.62 46.6,8.82 44.4,6.62 U4.4 U4.3
  Bottom Layer w0.3: v1(54.4,27.8) 54.4,24 47.5,17.1 v1(47.5,16.2)
BTN1: length 36
  Top Layer w0.3: 61.3,56.27 v1(61.3,54.9) ; v1(42.6,38.9) 39.25,38.9 U1.10
  Bottom Layer w0.3: v1(61.3,54.9) 61.3,50.5 55.4,44.6 55.4,40 53.6,38.2 43.3,38.2 v1(42.6,38.9)
BTN2: length 28
  Top Layer w0.3: U1.11 v1(37.7,37.73) ; 29.5,56.27 v1(29.5,55)
  Bottom Layer w0.3: v1(37.7,37.73) 37.7,46.6 33.06,51.24 28.06,51.24 27.5,51.8 27.5,53 v1(29.5,55)
BTN3: length 36.8
  Top Layer w0.3: 16.5,56.27 v1(16.5,54.7) ; U1.12 v1(37.6,36.46)
  Bottom Layer w0.3: v1(37.6,36.46) 36.9,37.16 36.9,45.8 32.37,50.33 20.87,50.33 v1(16.5,54.7)
BUZZER: length 46.9
  Top Layer w0.5: 无源蜂鸣器.1 v1(14.9,39.1) ; 43.58,32.57 v1(43.58,30.9)
  Bottom Layer w0.3: v1(43.58,30.9) 41.7,30.9 36.1,36.5 36.1,42.9 31.1,47.9 23.1,47.9 14.9,39.7 v1(14.9,39.1)
CJSH_RX: length 18.4
  Top Layer w0.254: U1.28 v1(59.8,37.73)
  Bottom Layer w0.254: CJSH20-CH2O.5 69.95,33.15 67.4,35.7 66.1,35.7 64.07,37.73 v1(59.8,37.73) ; 72.95,33.3 73.1,33.45
CJSH_TX: length 18.2
  Top Layer w0.254: U1.27 v1(59.8,36.46)
  Bottom Layer w0.254: v1(59.8,36.46) 64.14,36.46 65.9,34.7 67,34.7 69.85,31.85 73.05,31.85 CJSH20-CH2O.6
CS: length 35.5
  Top Layer w0.3: U1.29 v1(58.7,39) ; 33.3,23.24 34.66,23.24 v1(35,22.9)
  Bottom Layer w0.3: v1(35,22.9) 36.4,24.3 46.5,24.3 49.85,27.65 49.85,28.67 56.1,34.92 56.1,36.4 v1(58.7,39)
D+: length 9
  Top Layer w0.254: USB.B6 69.85,22.95 v1(69.5,22.6) 69.5,22.2 69.75,21.95 USB.A6
  Top Layer w0.3: U3.5 v1(65.7,23.14)
  Bottom Layer w0.3: v1(69.5,22.6) 69.5,22.4 69,21.9 67.9,21.9 66.66,23.14 v1(65.7,23.14)
D-: length 10.7
  Top Layer w0.254: USB.B7 71.45,21.45 71.7,21.7 71.7,22.3 71.55,22.45 USB.A7
  Top Layer w0.3: v1(68.6,22.6) 68.6,22.3 69.45,21.45 USB.B7 ; U3.6 v1(65.7,24.41)
  Bottom Layer w0.3: v1(68.6,22.6) 66.79,24.41 v1(65.7,24.41)
DC: length 27
  Top Layer w0.3: v1(37.6,22.8) 36.16,24.24 33.3,24.24 ; 53.74,32.57 v1(53.74,29.9)
  Bottom Layer w0.3: v1(37.6,22.8) 47.3,22.8 51.65,27.15 51.65,27.81 v1(53.74,29.9)
DTR: length 18
  Top Layer w0.254: R10.1 49.3,16.8 v1(48.11,16.8) 48.11,17.5 47.9,17.7 45.8,17.7 45.65,17.85 Q1.2 ; U3.13 v1(56.7,21.86)
  Bottom Layer w0.254: v1(56.7,21.86) 56.66,21.9 53.21,21.9 v1(48.11,16.8)
K: length 20.1
  Top Layer w0.3: R15.2 37.4,26.7 37.4,34 35.16,36.24 34.7,36.24 ; 34.7,36.24 33.3,36.24 ; 34.7,36.24 34.7,36.5 34.46,36.74 33.3,36.74 ; 34.7,36.24 34.7,36 34.44,35.74 33.3,35.74
LR: length 36.7
  Top Layer w0.254: U1.7 38,42.81 37.99,42.8 37.3,42.8 36.3,43.8 36.3,45.32 34.42,47.2 R22.1 34,47.2 v1(32.8,48.4) ; 光敏.1 v1(9.62,54.7)
  Bottom Layer w0.254: 32.7,48.5 32.2,49 15.32,49 v1(9.62,54.7)
MISO: length 34.9
  Top Layer w0.3: 33.3,25.74 35.56,25.74 v1(36.3,25) ; U1.31 v1(58.7,41.54)
  Bottom Layer w0.3: v1(58.7,41.54) 58.24,41.54 57.6,40.9 57.6,40.1 43.4,25.9 37.2,25.9 v1(36.3,25)
MOSI: length 45.4
  Top Layer w0.3: v1(61.6,49) 61.44,49.16 U1.37 ; v1(35,25) 34.76,25.24 33.3,25.24
  Bottom Layer w0.3: v1(61.6,49) 56.8,44.2 56.8,40.3 43.1,26.6 36.6,26.6 v1(35,25)
PMS_RX: length 41.3
  Top Layer w0.254: U1.9 40.3,40.27 40.33,40.3 43.1,40.3 44.3,39.1 52.2,39.1 53,39.9 53,44.4 v1(54.9,46.3)
  信号层 w0.254: v1(54.9,46.3) 60.97,46.3 v1(61.6,46.93)
  Bottom Layer w0.254: PMS7003.3 73.05,49.7 64.3,49.7 61.7,47.1
PMS_TX: length 43.2
  Top Layer w0.254: v1(54.6,47.3) 52.22,44.92 52.22,40.32 51.7,39.8 44.9,39.8 43.16,41.54 U1.8
  信号层 w0.254: v1(61.6,48) 60.9,47.3 v1(54.6,47.3)
  Bottom Layer w0.254: v1(61.6,48) 64.1,50.5 68.8,50.5 70.4,52.1 72.8,52.1 73.5,52.8
RST: length 79.1
  Top Layer w0.3: v1(25.3,46.6) 25.3,48.7 26.93,50.33 30,50.33 ; U1.3 36.81,47.89 35.6,49.1 33.2,49.1 C4.2 ; Q2.3 43.2,16.4 42.4,15.6 38.2,15.6 36.8,17 v1(35.8,17) 35.8,8.8 33.62,6.62 U2.4 U2.3
  Top Layer w0.5: C4.2 31.9,50.4 R8.1
  Bottom Layer w0.3: v1(35.8,17) 35.7,17 33.5,19.2 33.5,43 29.9,46.6 v1(25.3,46.6)
RTS: length 22.8
  Top Layer w0.3: Q2.2 42.25,17.85 v1(41.87,17.47) 41.3,16.9 R11.1 ; v1(56.9,20.1) 57.4,20.59 U3.14
  Bottom Layer w0.3: v1(56.9,20.1) 52.3,20.1 47.7,15.5 43.83,15.5 v1(41.87,17.47)
RX: length 32
  Top Layer w0.3: U3.2 62.88,19.33 61.6,20.6 61.6,44.2 60.45,45.35 U1.34
SCD40_SCL: length 40
  Top Layer w0.254: 23.54,13.75 28.81,13.75 29.42,14.35 ; v1(39.03,27.79) 39.02,27.8 39.02,33.19 38.45,33.77 ; 16.6,13.98 17.09,13.98 18.39,12.68 21.34,12.68 21.71,13.06 21.71,13.42 22,13.7 23.3,13.7
  信号层 w0.254: v1(39.03,27.79) 39.03,27.79 39.03,19.94 38.47,19.38 37.75,19.38 37.71,19.34 37.31,19.34 32.45,14.47 29.39,14.47
  vias: v1(29.46,14.43)
SCD40_SDA: length 40.9
  Top Layer w0.254: 19.9,13.66 19.2,13.66 18.89,13.98 18.89,14.55 18.38,15.06 16.22,15.06 ; 20.13,14.08 20.13,14.58 20.76,15.22 28.48,15.22 ; 38.36,35.25 37.92,34.81 37.92,32.71 38.15,32.48 38.15,28.65
  信号层 w0.254: 28.57,15.32 32.32,15.32 37,20 38.21,20 38.4,20.19 38.4,26.54 38.15,26.79 38.15,28.5
  vias: v1(28.55,15.25) v1(38.13,28.6)
SCLK: length 38.8
  Top Layer w0.3: v1(36.2,22.9) 35.36,23.74 33.3,23.74 ; 56.8,40.3 v1(58.65,40.3)
  Bottom Layer w0.3: v1(58.65,40.3) 59.1,40.3 59.7,39.7 59.7,38.5 56.9,35.7 56.9,34.49 50.52,28.1 50.52,27.22 47,23.7 37,23.7 v1(36.2,22.9)
SPI_RESET: length 28.3
  Top Layer w0.3: v1(55,35.2) 56.84,35.2 U1.26 ; v1(37.7,25) 36.46,26.24 33.3,26.24
  Bottom Layer w0.3: v1(37.7,25) 43.9,25 54.1,35.2 v1(55,35.2)
TX: length 32.4
  Top Layer w0.3: U1.35 56.93,46.7 60.8,46.7 62.2,45.3 62.2,21.1 62.71,20.59 U3.3
$1N3236: length 17.5
  Top Layer w0.254: USB.B5 69.45,23.95 v1(69.1,23.6)
  Top Layer w0.3: R6.1 v1(56.73,23.1)
  Bottom Layer w0.3: v1(56.73,23.1) 61.2,23.1 63.9,25.8 66.9,25.8 v1(69.1,23.6)
$1N3239: length 16.2
  Top Layer w0.254: v1(68.74,20.95) USB.A5
  Top Layer w0.3: 55.35,21.01 v1(56.78,21.01)
  Bottom Layer w0.3: v1(68.74,20.95) 67.45,20.95 66.3,22.1 58.85,22.1 57.7,20.95 56.84,20.95 v1(56.78,21.01)
$1N4518: length 9.2
  Top Layer w0.3: Q2.1 44.15,17.75 v1(44.4,17.5) ; v1(49.4,19.9) R10.2
  Bottom Layer w0.3: v1(44.4,17.5) 45.3,16.6 46.1,16.6 v1(49.4,19.9)
$1N4546: length 8.9
  Top Layer w0.3: R11.2 41.4,20 47.3,20 47.55,19.75 Q1.1
$1N5000: length 6.2
  Top Layer w0.6: 57.8,7.4 57.95,7.55 U5.3
  Top Layer w1: 57.8,7.4 55.45,5.05 53.79,5.05
$1N5124: length 7.5
  Top Layer w0.5: R13.2 C6.1 ; C6.1 61.6,12.8 U5.5 ; C6.1 61.4,12.8 R12.1
$1N7211: length 4.9
  Top Layer w0.3: Q3.1 45.85,21.8 R16.2 48.3,21.8
$1N8578: length 2.9
  Top Layer w0.3: Q3.3 40.6,21.5 R15.1

## Copper pours and planes (outline as drawn; the poured copper is in the pictures)
GND on Top Layer: 44.5,44 50.3,44 50.3,41.9 44.5,41.9
GND on Top Layer: 0.7,57.2 77.4,57.2 77.4,0.9 0.7,0.9
GND on Top Layer: 46.4,45.7 48.3,45.7 48.3,40.1 46.4,40.1
GND on Bottom Layer: 0.7,57.2 77.4,57.2 77.4,0.9 0.7,0.9
GND on 信号层: 0.7,57.2 77.4,57.2 77.4,0.9 0.7,0.9
GND on GND: 0.7,57.2 77.4,57.2 77.4,0.9 0.7,0.9

Small or netless copper shapes (teardrops, artwork), in the pictures only: 218 on Top Layer, 51 on Bottom Layer, 8 on 信号层

## Text on the board
Top Silkscreen Layer: 40 | 1 | TX | 5V | G | RX | RST | BOOT | Chdon / Air Detect / V1.0
